# Altium schematic sheet Sheet6.SchDoc
size A4
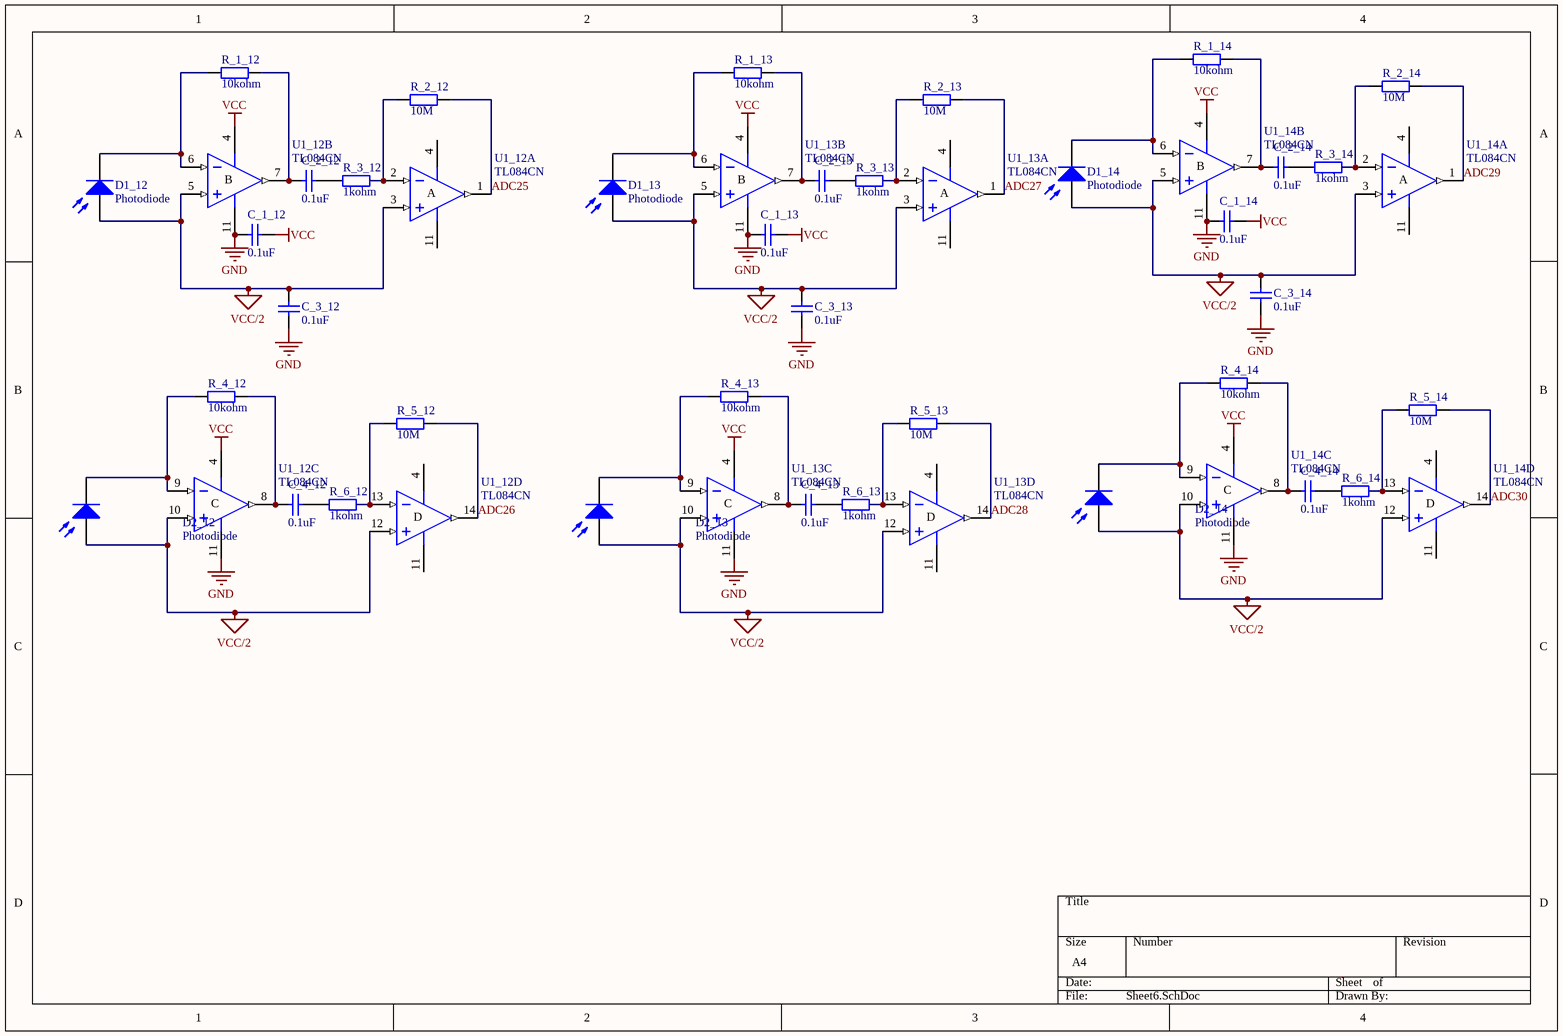
[diagram p0: Sheet6.SchDoc]

## Parts
C_1_12  0.1uF  [cms805 - mini]
C_1_13  0.1uF  [cms805 - mini]
C_1_14  0.1uF  [cms805 - mini]
C_2_12  0.1uF  [cms805 - mini]
C_2_13  0.1uF  [cms805 - mini]
C_2_14  0.1uF  [cms805 - mini]
C_3_12  0.1uF  [cms805 - mini]
C_3_13  0.1uF  [cms805 - mini]
C_3_14  0.1uF  [cms805 - mini]
C_4_12  0.1uF  [cms805 - mini]
C_4_13  0.1uF  [cms805 - mini]
C_4_14  0.1uF  [cms805 - mini]
D1_12  Photodiode  [TEMD1000]
D1_13  Photodiode  [TEMD1000]
D1_14  Photodiode  [TEMD1000]
D2_12  Photodiode  [TEMD1000]
D2_13  Photodiode  [TEMD1000]
D2_14  Photodiode  [TEMD1000]
R_1_12  10kohm  [cms805 - mini]
R_1_13  10kohm  [cms805 - mini]
R_1_14  10kohm  [cms805 - mini]
R_2_12  10M  [cms805 - mini]
R_2_13  10M  [cms805 - mini]
R_2_14  10M  [cms805 - mini]
R_3_12  1kohm  [cms805 - mini]
R_3_13  1kohm  [cms805 - mini]
R_3_14  1kohm  [cms805 - mini]
R_4_12  10kohm  [cms805 - mini]
R_4_13  10kohm  [cms805 - mini]
R_4_14  10kohm  [cms805 - mini]
R_5_12  10M  [cms805 - mini]
R_5_13  10M  [cms805 - mini]
R_5_14  10M  [cms805 - mini]
R_6_12  1kohm  [cms805 - mini]
R_6_13  1kohm  [cms805 - mini]
R_6_14  1kohm  [cms805 - mini]
U1_12  TL084CN  [TSSOP14]  (parts A,B,C,D of 4)
U1_13  TL084CN  [TSSOP14]  (parts A,B,C,D of 4)
U1_14  TL084CN  [TSSOP14]  (parts A,B,C,D of 4)

## Nets
GND: C_1_12.1 C_1_13.1 C_1_14.1 C_3_12.1 C_3_13.1 C_3_14.1 U1_12.11(V-) U1_13.11(V-) U1_14.11(V-)
VCC: C_1_12.2 C_1_13.2 C_1_14.2 U1_12.4(V+) U1_13.4(V+) U1_14.4(V+)
VCC/2: C_3_12.2 C_3_13.2 C_3_14.2 D1_12.1(A) D1_13.1(A) D1_14.1(A) D2_12.1(A) D2_13.1(A) D2_14.1(A) U1_12.3(IN+) U1_12.5(IN+) U1_12.10(IN+) U1_12.12(IN+) U1_13.3(IN+) U1_13.5(IN+) U1_13.10(IN+) U1_13.12(IN+) U1_14.3(IN+) U1_14.5(IN+) U1_14.10(IN+) U1_14.12(IN+)
ADC25: R_2_12.2 U1_12.1(OUT)
ADC26: R_5_12.2 U1_12.14(OUT)
ADC27: R_2_13.2 U1_13.1(OUT)
ADC28: R_5_13.2 U1_13.14(OUT)
ADC29: R_2_14.2 U1_14.1(OUT)
ADC30: R_5_14.2 U1_14.14(OUT)
NetC_2_12_1: C_2_12.1 R_3_12.1
NetC_2_12_2: C_2_12.2 R_1_12.2 U1_12.7(OUT)
NetC_2_13_1: C_2_13.1 R_3_13.1
NetC_2_13_2: C_2_13.2 R_1_13.2 U1_13.7(OUT)
NetC_2_14_1: C_2_14.1 R_3_14.1
NetC_2_14_2: C_2_14.2 R_1_14.2 U1_14.7(OUT)
NetC_4_12_1: C_4_12.1 R_6_12.1
NetC_4_12_2: C_4_12.2 R_4_12.2 U1_12.8(OUT)
NetC_4_13_1: C_4_13.1 R_6_13.1
NetC_4_13_2: C_4_13.2 R_4_13.2 U1_13.8(OUT)
NetC_4_14_1: C_4_14.1 R_6_14.1
NetC_4_14_2: C_4_14.2 R_4_14.2 U1_14.8(OUT)
NetD1_12_2: D1_12.2(K) R_1_12.1 U1_12.6(IN-)
NetD1_13_2: D1_13.2(K) R_1_13.1 U1_13.6(IN-)
NetD1_14_2: D1_14.2(K) R_1_14.1 U1_14.6(IN-)
NetD2_12_2: D2_12.2(K) R_4_12.1 U1_12.9(IN-)
NetD2_13_2: D2_13.2(K) R_4_13.1 U1_13.9(IN-)
NetD2_14_2: D2_14.2(K) R_4_14.1 U1_14.9(IN-)
NetR_2_12_1: R_2_12.1 R_3_12.2 U1_12.2(IN-)
NetR_2_13_1: R_2_13.1 R_3_13.2 U1_13.2(IN-)
NetR_2_14_1: R_2_14.1 R_3_14.2 U1_14.2(IN-)
NetR_5_12_1: R_5_12.1 R_6_12.2 U1_12.13(IN-)
NetR_5_13_1: R_5_13.1 R_6_13.2 U1_13.13(IN-)
NetR_5_14_1: R_5_14.1 R_6_14.2 U1_14.13(IN-)

## Notes on the sheet
- (in symbol TL084CN, part A) A
- (in symbol TL084CN, part B) B
- (in symbol TL084CN, part C) C
- (in symbol TL084CN, part D) D

## Library data of the parts
C_1_12-C_1_14 C_2_12-C_2_14 C_3_12-C_3_14 C_4_12-C_4_14 = Capa
R_1_12-R_1_14 R_2_12-R_2_14 R_3_12-R_3_14 R_4_12-R_4_14 R_5_12-R_5_14 R_6_12-R_6_14 = Resistance
U1_12-U1_14 = TL084CN: General-Purpose J-FET Quad Operational Amplifier; Published: 24-Aug-2001; LatestRevisionDate: 06-Jun-2005; LatestRevisionNote: Stylized 3D Model Added.; DatasheetVersion: Jan-1999; PackageVersion: Jan-1997; PackageReference: DIP14; Publisher: Altium Limited; PackageDescription: DIP; 14 Leads; Row Spacing 7.62 mm; Pitch 2.54 mm; ComponentLink1Description: Manufacturer Link; ComponentLink1URL: http://www.st.com/; ComponentLink2Description: Datasheet; ComponentLink2URL: http://www.st.com/stonline/products/literature/ds/2301/tl084.pdf
D1_12-D1_14 D2_12-D2_14 = Photodiode: Published: 24-Mar-1999; LatestRevisionDate: 17-Jul-2002; LatestRevisionNote: Re-released for DXP Platform.; PackageReference: PIN2; Publisher: Altium Limited